# Altium schematic sheet MasterBoard_Wiring.SchDoc
size Tabloid; PageSetup: Record=PageOptions|CenterHorizontal=True|CenterVertical=True|PrintScale=0.64|XCorrection=1.00|YCorrection=1.00|PrintKind=0|BorderSize=5000000|LeftOffset=0|BottomOffset=0|Orientation=2|PaperLength=1000|PaperWidth=1000|Scale=100|PaperSource=7|PrintQuality=-4|MediaType=1|DitherType=10|PaperKind=Letter|PrintScaleMode=1
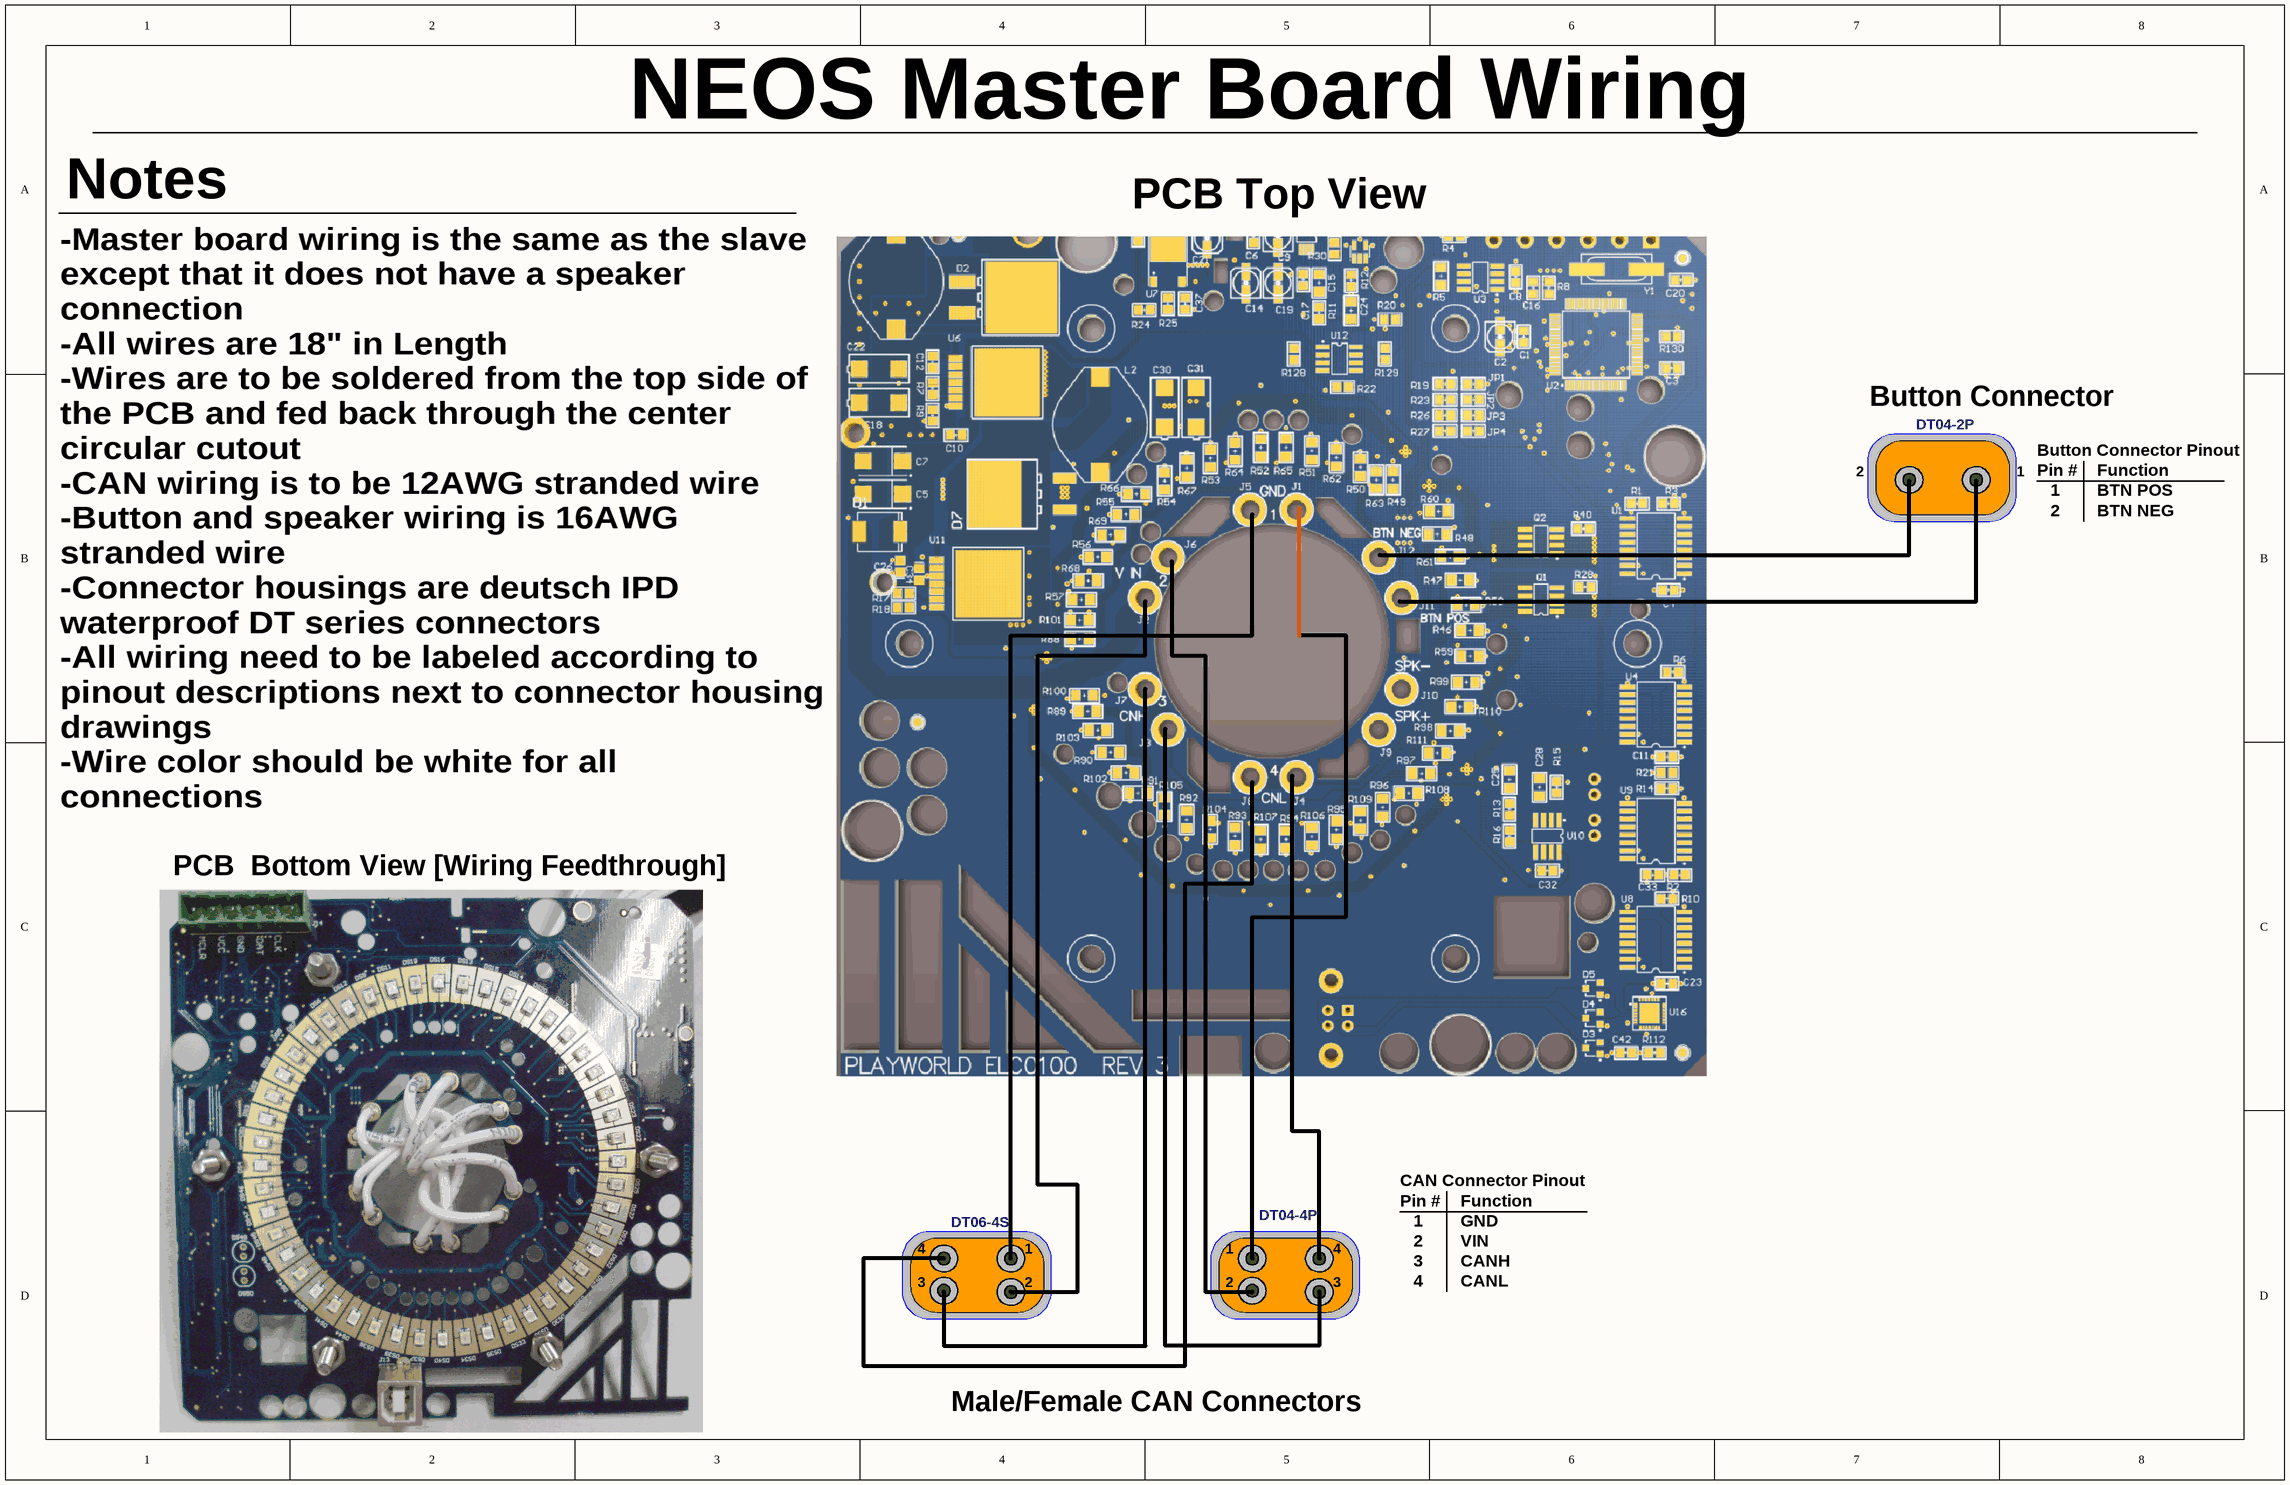
[diagram p0: MasterBoard_Wiring.SchDoc]

## Notes on the sheet
- NEOS Master Board Wiring
- Notes
- PCB Top View
- Button Connector
- DT04-2P
- 2
- 1
- Button Connector Pinout
- Pin #
- Function
- BTN POS
- BTN NEG
- -Master board wiring is the same as the slave except that it does not have a speaker connection
  -All wires are 18" in Length
  -Wires are to be soldered from the top side of the PCB and fed back through the center circular cutout
  -CAN wiring is to be 12AWG stranded wire
  -Button and speaker wiring is 16AWG stranded wire
  -Connector housings are deutsch IPD waterproof DT series connectors
  -All wiring need to be labeled according to pinout descriptions next to connector housing drawings
  -Wire color should be white for all connections
  -Wire bundles should be zip-tied every 3"
- PCB  Bottom View [Wiring Feedthrough]
- DT06-4S
- DT04-4P
- CAN Connector Pinout
- GND
- 3
- 4
- VIN
- CANH
- CANL
- Male/Female CAN Connectors